# EAGLE design H bridge PNP & NPN transistors (EAGLE 7.5.0)
CNAME: H bridge NPN & PNP transistors; DESIGNER: Mahmoud Karam
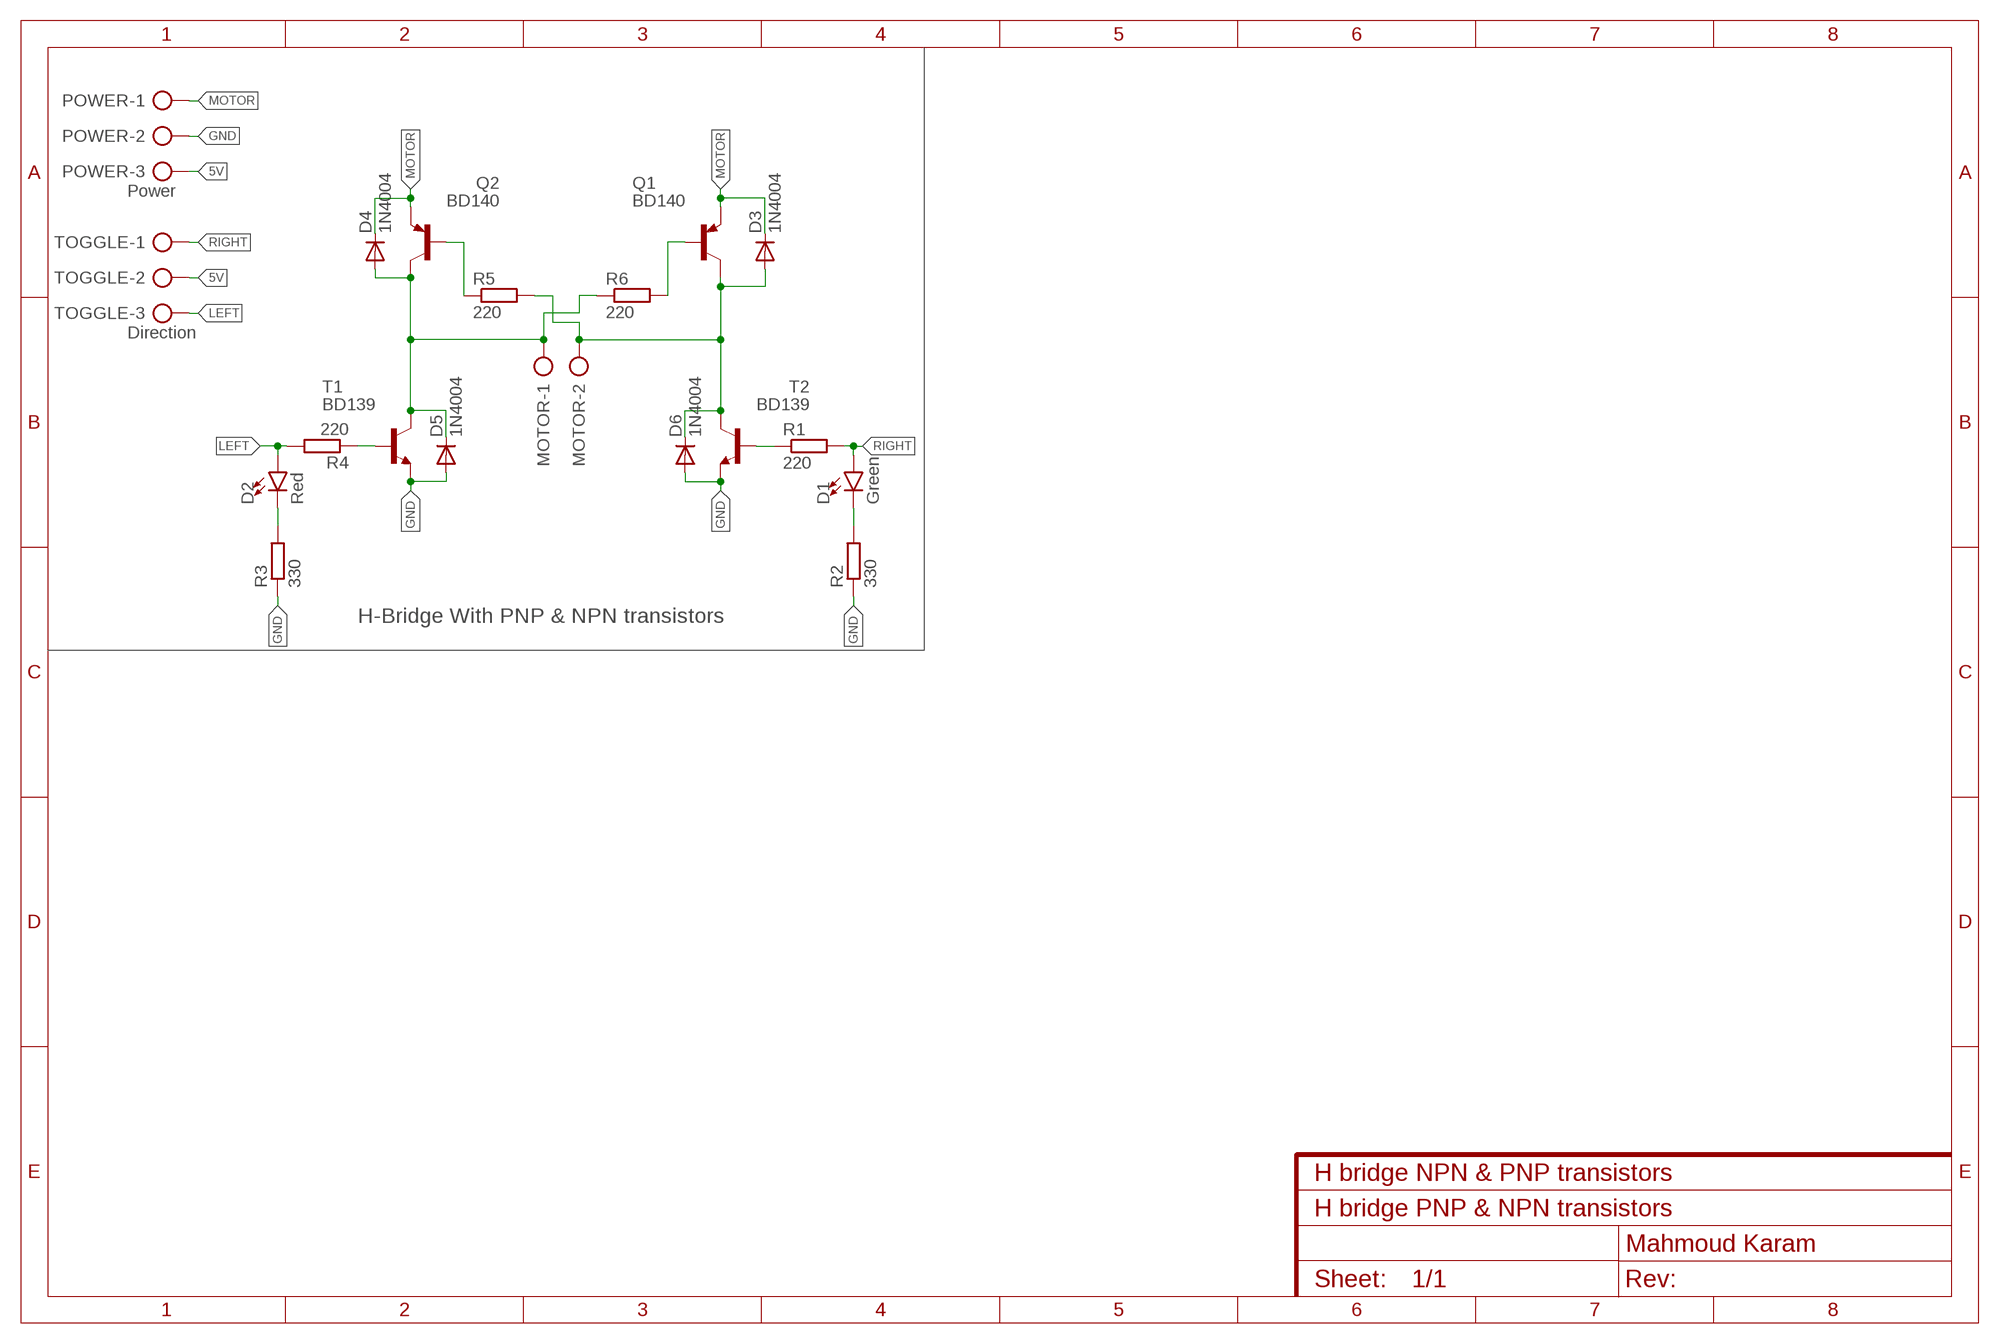
[diagram p0: schematic, sheet 1]

## Parts
D1  Green  LED5MM  [LED_5MM]
D2  Red  LED5MM  [LED_5MM]
D3  1N4004  [DO41-10]
D4  1N4004  [DO41-10]
D5  1N4004  [DO41-10]
D6  1N4004  [DO41-10]
MOTOR  AK500/2-H  [AK500/2-H]
POWER  Power  AK500/3-H  [AK500/3-H]
Q1  BD140  [TO126]
Q2  BD140  [TO126]
R1  220  R-EU_0207/7  [0207/7]
R2  330  R-EU_0207/7  [0207/7]
R3  330  R-EU_0207/7  [0207/7]
R4  220  R-EU_0207/7  [0207/7]
R5  220  R-EU_0207/7  [0207/7]
R6  220  R-EU_0207/7  [0207/7]
T1  BD139  [TO126]
T2  BD139  [TO126]
TOGGLE  Direction  AK500/3-H  [AK500/3-H]

## Nets
5V: POWER.3 TOGGLE.2
GND: D5.A D6.A POWER.2 R2.1 R3.1 T1.1(E) T2.1(E)
LEFT [Base]: D2.A R4.2 TOGGLE.3
MOTOR: D3.C D4.C POWER.1 Q1.1(E) Q2.1(E)
N$3 [Power]: D4.A D5.C MOTOR.1 Q2.2(C) R6.1 T1.2(C)
N$4 [Base]: Q2.3(B) R5.1
N$5 [Power]: D3.A D6.C MOTOR.2 Q1.2(C) R5.2 T2.2(C)
N$6 [Base]: Q1.3(B) R6.2
N$10 [Base]: D2.K(C) R3.2
N$11 [Base]: R4.1 T1.3(B)
N$12 [Base]: D1.K(C) R2.2
N$17 [Base]: R1.1 T2.3(B)
RIGHT [Base]: D1.A R1.2 TOGGLE.1

## Notes on the sheet
- H-Bridge With PNP & NPN transistors

## Library data of the parts
D1 D2 = SparkFun-LED:LED: LED (Generic) Standard schematic elements and footprints for 5mm, 3mm, 1206, and 0603 sized LEDs. Generic LEDs with no color specified.
D3-D6 = diode:1N4004: DIODE general purpose rectifier, 1 A
MOTOR = con-ptr500:AK500/2-H: CONNECTOR Aug. 2004 / PTR Meßtechnik: Die Bezeichnung der Serie AK505 wurde geändert. Es handelt sich hierbei um AK500 in horizontaler Ausführung.; OC_FARNELL: unknown; OC_NEWARK: unknown
POWER TOGGLE = con-ptr500:AK500/3-H: CONNECTOR Aug. 2004 / PTR Meßtechnik: Die Bezeichnung der Serie AK505 wurde geändert. Es handelt sich hierbei um AK500 in horizontaler Ausführung.; OC_FARNELL: unknown; OC_NEWARK: unknown
Q1 Q2 = transistor-pnp:BD140: PNP Transistor
R1-R6 = resistor:R-EU_: RESISTOR, European symbol
T1 T2 = transistor-neu-to92:BD139: NPN TRANSISTOR

## Net classes
1 Base: width 0.1 mm
2 Power: width 0.8 mm

## Board
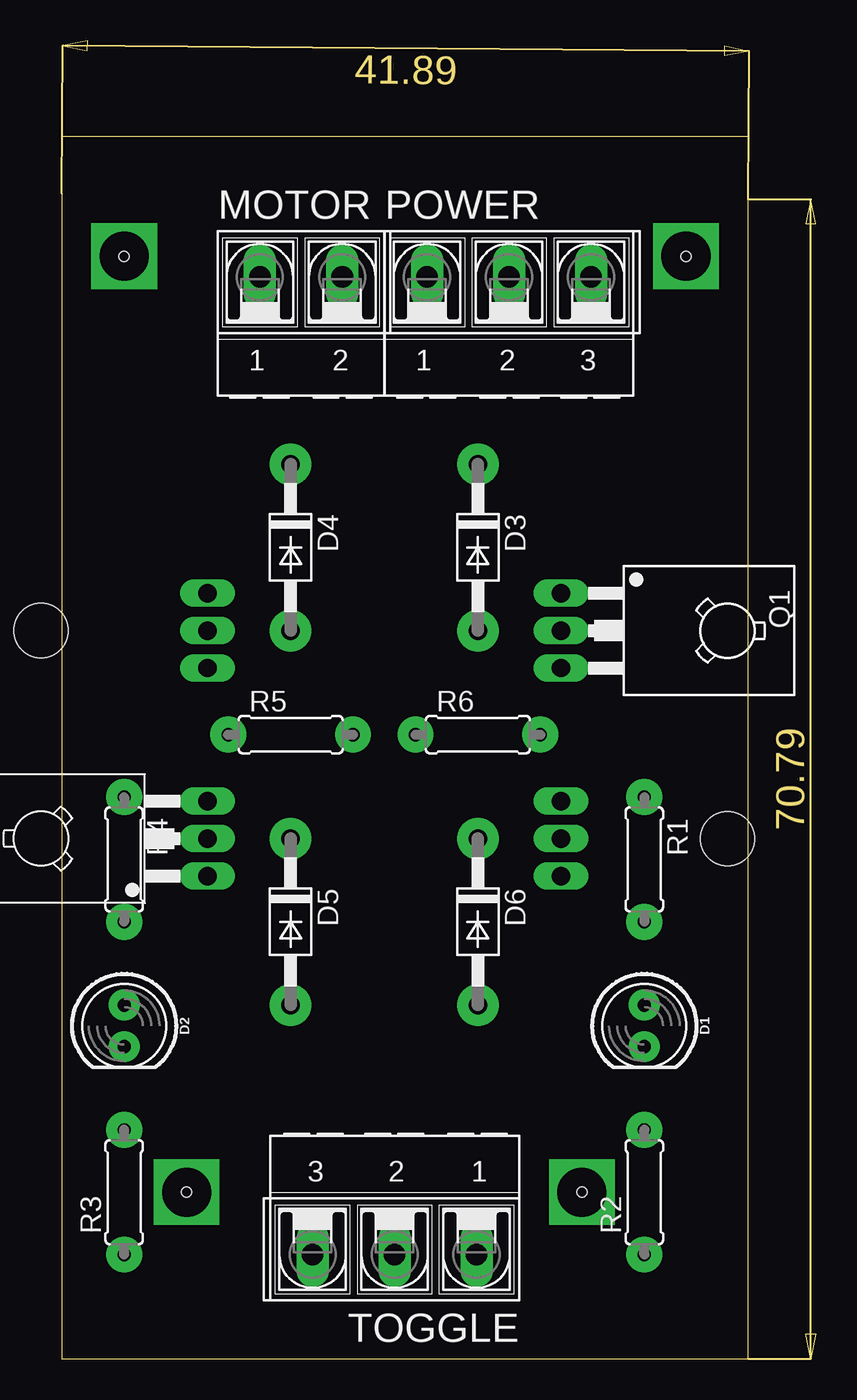
[diagram p1: board, top side]
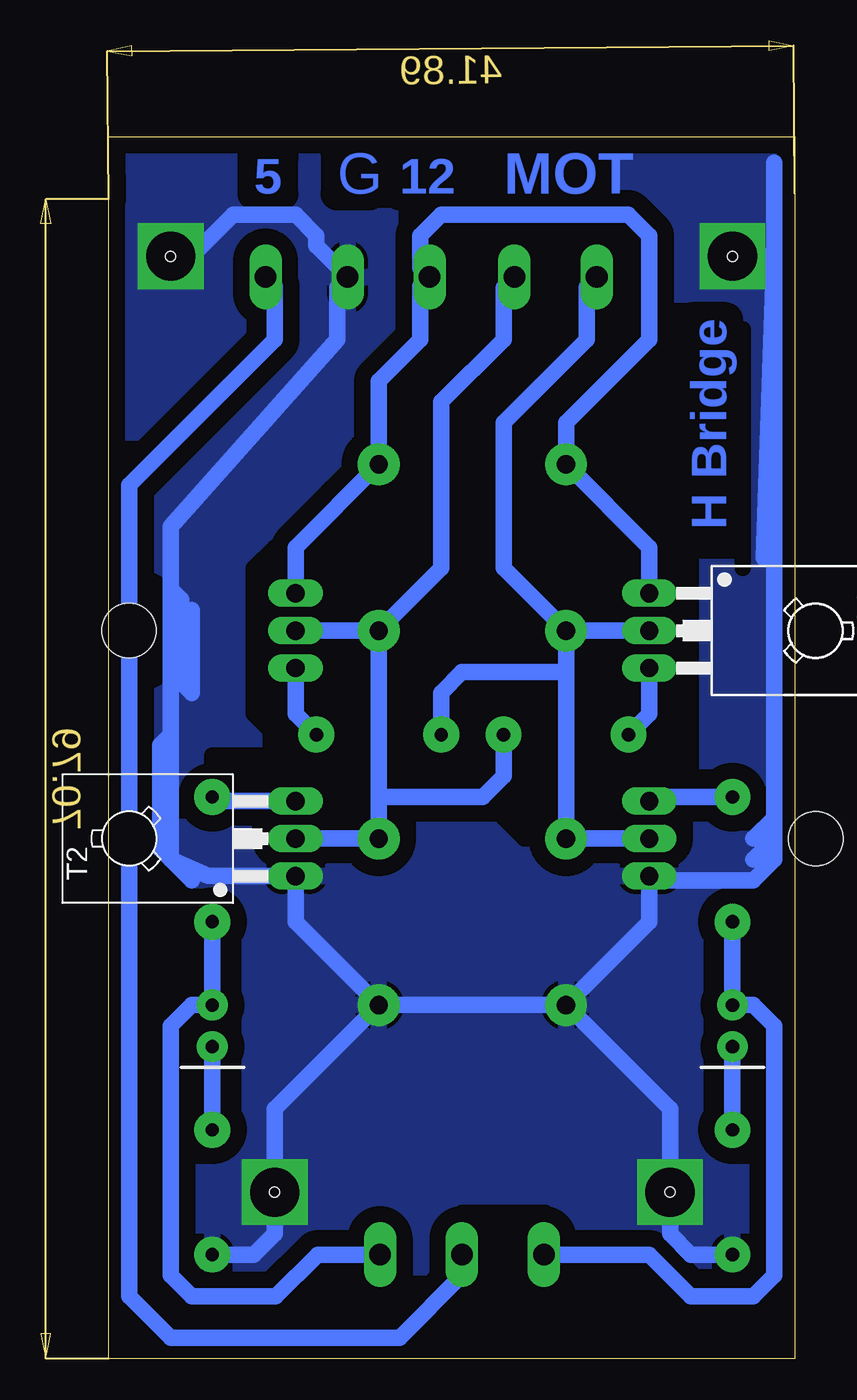
[diagram p2: board, bottom side, seen from below]

Size 41.89 x 74.6 mm. Coordinates in mm from the lower left corner, seen from the top.
Outline: 0,0 41.89,0 41.89,74.6 0,74.6 0,0
Copper layers (1*16): Top 0.035mm / dielectric 1.5mm / Bottom 0.035mm
Design rules "default": minimum track width 1mm, minimum drill 0.2mm, track to track 1mm, track to pad 1mm, pad to pad 1mm, via to via 1mm, smd to smd 8mil, copper to edge 1mm, drill to drill 1mm, minimum pad ring 10mil, minimum via ring 8mil, stop-mask expansion 4mil, vias tented up to drill 0mil, thermal gap 10mil
Holes 0.6 mm at 7.62,10.16 31.75,10.16 3.81,67.31 38.1,67.31
bRestrict: 16 lines

### Footprints (pad centres in the part's own frame; a part is rotated, then mirrored left to right if it is on the bottom)
LED_5MM = drill 0.813 pad 1.88: A -1.27,0; K 1.27,0
DO41-10 = drill 1.118 pad 2.54: A 5.08,0; C -5.08,0
AK500/2-H = drill 1.321 long: 1 -2.515,0; 2 2.515,0
AK500/3-H = drill 1.321 long: 1 -5.004,0; 2 0,0; 3 5.004,0
TO126 = drill 1.118 long: 1 -2.286,-5.08; 2 0,-5.08; 3 2.286,-5.08 | hole 3.302: 0,5.08
0207/7 = drill 0.813 pad 2.184: 1 -3.81,0; 2 3.81,0

### Placement (x,y rotation side)
D1  35.56,20.32 270 top
D2  3.81,20.32 270 top
D3  25.4,49.53 270 top
D4  13.97,49.53 270 top
D5  13.97,26.67 270 top
D6  25.4,26.67 270 top
MOTOR  14.61,66.04 0 top
POWER  27.3,66.04 0 top
Q1  35.56,44.45 270 top
Q2  3.81,44.45 270 bottom
R1  35.56,30.48 270 top
R2  35.56,10.16 90 top
R3  3.81,10.16 90 top
R4  3.81,30.48 270 top
R5  13.97,38.1 0 top
R6  25.4,38.1 0 top
T1  3.81,31.75 90 top
T2  35.56,31.75 90 bottom
TOGGLE  20.32,6.35 180 top

### Tracks (layer width: path | path; a pad name or v marks a point on that pad's centre or on a via)
5V
  Bottom 1.016: TOGGLE.2 20.32,5.08 24.13,1.27 38.1,1.27 40.64,3.81 40.64,53.34 31.75,62.23 31.75,65.48 POWER.3
GND  (via drill 3 pad 3.81)
  Bottom 1.016: 8.89,29.21 8.89,26.67 D5.A | D5.A D6.A | R2.1 33.02,6.35 31.75,7.62 31.75,15.24 D6.A | R3.1 6.35,6.35 7.62,7.62 7.62,15.24 D5.A | D6.A 30.48,26.67 T2.1 35.81,29.46 38.1,30.48 38.1,38.1 | 38.1,38.1 38.1,46.99 | 38.1,46.99 38.1,50.8 27.94,62.23 27.94,65.41 POWER.2 29.21,67.94 29.21,68.58 30.48,69.85 34.29,69.85 36.83,67.31 v38.1,67.31 | v3.81,67.31 1.27,67.31 | 1.27,67.31 1.27,66.04 1.27,48.9 | 1.27,48.9 1.27,33.02 | 1.27,31.75 1.27,30.48 2.54,29.21 8.89,29.21 | 8.89,29.21 T1.1 | 2.54,30.48 1.27,31.75 | 1.27,31.75 1.27,33.02 | 1.27,33.02 2.54,31.75 | 38.1,46.99 37.47,46.35 37.47,41.27 36.83,40.64 36.83,45.72 | 38.1,38.1 38.73,37.47 38.73,31.11 36.83,29.21 | 1.27,48.9 1.91,48.9 1.27,67.31 | 1.27,67.31 1.27,73.03
  other vias: 7.62,10.16 31.75,10.16
  pour Bottom: 0,74.93 41.91,74.93 41.91,0 0,0
LEFT
  Bottom 1.016: R4.2 D2.A 2.54,21.59 1.27,20.32 1.27,5.08 2.54,3.81 6.35,3.81 8.89,6.35 TOGGLE.3
MOTOR
  Bottom 1.016: Q1.1 30.48,49.53 D3.C 25.4,59.69 22.86,62.23 22.86,65.48 POWER.1 22.86,66.6 22.86,68.58 21.59,69.85 10.16,69.85 8.89,68.58 8.89,62.23 13.97,57.15 D4.C 8.89,49.53 Q2.1
N$3
  Bottom 1.016: T1.2 D5.C 13.97,41.91 | 13.97,41.91 D4.A | R6.1 21.59,40.64 20.32,41.91 13.97,41.91 | Q2.2 D4.A | D4.A 17.78,48.26 17.78,57.15 12.7,62.23 12.7,65.43 MOTOR.1
N$4
  Bottom 1.016: Q2.3 8.89,39.37 R5.1
N$5
  Bottom 1.016: Q1.2 D3.A | 25.4,34.29 D6.C T2.2 | 25.4,34.29 D3.A | R5.2 17.78,35.56 19.05,34.29 25.4,34.29 | D3.A 21.59,48.26 21.59,58.42 17.78,62.23 17.78,65.38 MOTOR.2
N$6
  Bottom 1.016: Q1.3 30.48,39.37 R6.2
N$10
  Bottom 1.016: D2.K R3.2
N$11
  Bottom 1.016: R4.1 8.64,34.29 T1.3
N$12
  Bottom 1.016: D1.K R2.2
N$17
  Bottom 1.016: T2.3 35.31,34.04 R1.1
RIGHT
  Bottom 1.016: R1.2 D1.A 36.83,21.59 38.1,20.32 38.1,5.08 36.83,3.81 31.67,3.81 29.13,6.35 TOGGLE.1

### Text on the board
Bottom: MOT | 12 | G | 5 | H Bridge